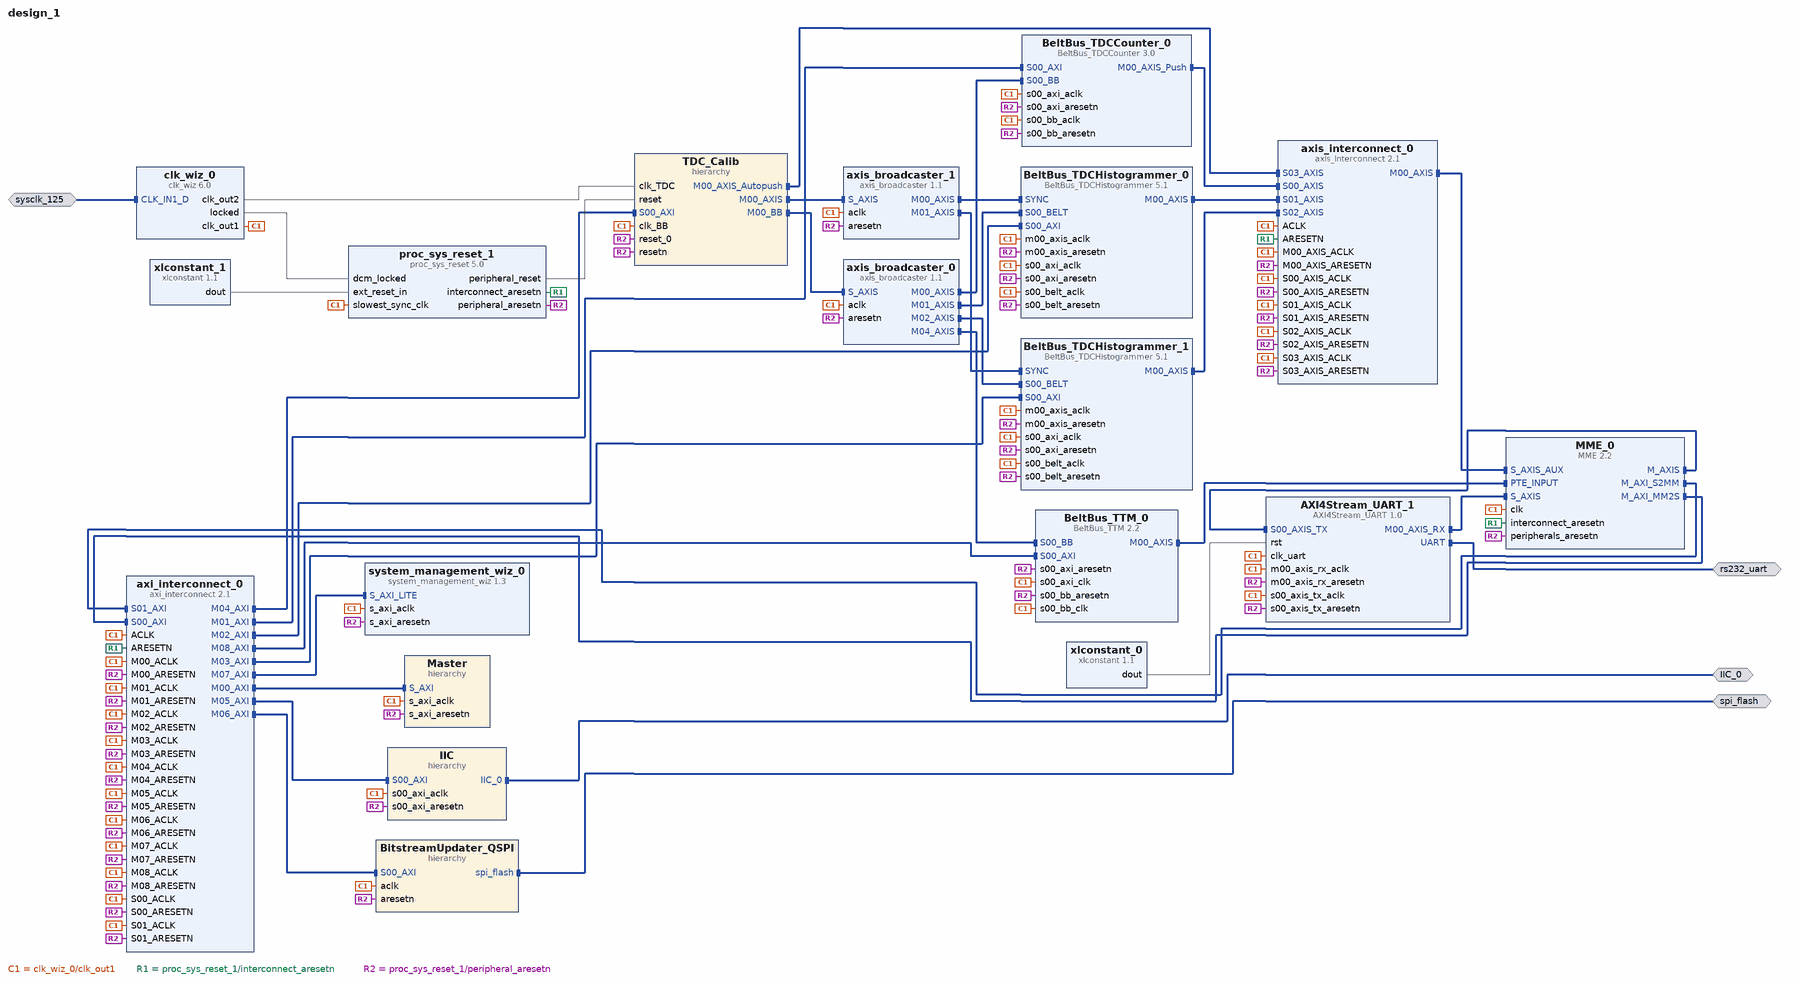
[diagram p0: block diagram of the top level]
# Vivado block design design_1, xcku040-ffva1156-2-e, Vivado 2020.2
create_bd_design design_1

create_bd_intf_port -mode Master -vlnv xilinx.com:interface:iic_rtl:1.0 IIC_0
create_bd_intf_port -mode Master -vlnv xilinx.com:interface:uart_rtl:1.0 rs232_uart
create_bd_intf_port -mode Master -vlnv xilinx.com:interface:spi_rtl:1.0 spi_flash
create_bd_intf_port -mode Slave -vlnv xilinx.com:interface:diff_clock_rtl:1.0 sysclk_125
set_property -dict {CONFIG.FREQ_HZ 125000000} [get_bd_intf_ports sysclk_125]

create_bd_cell -type ip -vlnv TimeEngineers:ip:AXI4Stream_UART:1.0 AXI4Stream_UART_1
set_property -dict [list \
  CONFIG.UART_BAUD_RATE 115200 \
  CONFIG.UART_BOARD_INTERFACE rs232_uart \
  CONFIG.USE_BOARD_FLOW true \
] [get_bd_cells AXI4Stream_UART_1]
create_bd_cell -type ip -vlnv DigiLAB:ip:BeltBus_TDCCounter:3.0 BeltBus_TDCCounter_0
set_property -dict {CONFIG.BIT_COARSE 8 CONFIG.BIT_FID 2 CONFIG.NUM_CH 3} [get_bd_cells BeltBus_TDCCounter_0]
create_bd_cell -type ip -vlnv DigiLAB:ip:BeltBus_TDCHistogrammer:5.1 BeltBus_TDCHistogrammer_0
set_property -dict [list \
  CONFIG.BIN_ADDR_WIDTH 13 \
  CONFIG.BIN_DATA_WIDTH 27 \
  CONFIG.BIT_COARSE 8 \
  CONFIG.BIT_FID 2 \
  CONFIG.BIT_OVERFLOW 16 \
  CONFIG.NUM_CH 3 \
] [get_bd_cells BeltBus_TDCHistogrammer_0]
create_bd_cell -type ip -vlnv DigiLAB:ip:BeltBus_TDCHistogrammer:5.1 BeltBus_TDCHistogrammer_1
set_property -dict [list \
  CONFIG.BIN_ADDR_WIDTH 13 \
  CONFIG.BIN_DATA_WIDTH 27 \
  CONFIG.BIT_COARSE 8 \
  CONFIG.BIT_FID 2 \
  CONFIG.BIT_OVERFLOW 16 \
  CONFIG.NUM_CH 3 \
] [get_bd_cells BeltBus_TDCHistogrammer_1]
create_bd_cell -type ip -vlnv DigiLAB:ip:BeltBus_TTM:2.2 BeltBus_TTM_0
set_property -dict [list \
  CONFIG.BIT_COARSE 8 \
  CONFIG.BIT_FID 2 \
  CONFIG.CUSTOM_TRESHOLD false \
  CONFIG.INS_TIMEOUT_CYCLES 100000000 \
  CONFIG.TAIL_FIFO_DEPTH 16384 \
  CONFIG.TLAST_GEN_TIMEOUT_CYCLES 30 \
] [get_bd_cells BeltBus_TTM_0]
create_bd_cell -type hier BitstreamUpdater_QSPI
create_bd_cell -type hier IIC
create_bd_cell -type ip -vlnv DigiLAB:hier:MME:2.2 MME_0
set_property -dict [list \
  CONFIG.MAX_PACKET_LENGTH_PACKETIZER 131072 \
  CONFIG.PTE_AUXILIARY_PORTS true \
  CONFIG.TLAST_00 yes \
] [get_bd_cells MME_0]
create_bd_cell -type hier Master
create_bd_cell -type hier TDC_Calib
create_bd_cell -type ip -vlnv xilinx.com:ip:axi_interconnect:2.1 axi_interconnect_0
set_property -dict {CONFIG.NUM_MI 9 CONFIG.NUM_SI 2} [get_bd_cells axi_interconnect_0]
create_bd_cell -type ip -vlnv xilinx.com:ip:axis_broadcaster:1.1 axis_broadcaster_0
set_property -dict [list \
  CONFIG.HAS_TREADY 0 \
  CONFIG.M00_TDATA_REMAP {tdata[31:0]} \
  CONFIG.M01_TDATA_REMAP {tdata[31:0]} \
  CONFIG.M02_TDATA_REMAP {tdata[31:0]} \
  CONFIG.M03_TDATA_REMAP {tdata[31:0]} \
  CONFIG.M04_TDATA_REMAP {tdata[31:0]} \
  CONFIG.M_TDATA_NUM_BYTES 4 \
  CONFIG.NUM_MI 5 \
  CONFIG.S_TDATA_NUM_BYTES 4 \
] [get_bd_cells axis_broadcaster_0]
create_bd_cell -type ip -vlnv xilinx.com:ip:axis_broadcaster:1.1 axis_broadcaster_1
set_property -dict [list \
  CONFIG.HAS_TREADY 0 \
  CONFIG.M00_TDATA_REMAP {tdata[39:0]} \
  CONFIG.M01_TDATA_REMAP {tdata[39:0]} \
  CONFIG.M02_TDATA_REMAP {tdata[31:0]} \
  CONFIG.M03_TDATA_REMAP {tdata[31:0]} \
  CONFIG.M_TDATA_NUM_BYTES 5 \
  CONFIG.NUM_MI 2 \
  CONFIG.S_TDATA_NUM_BYTES 5 \
] [get_bd_cells axis_broadcaster_1]
create_bd_cell -type ip -vlnv xilinx.com:ip:axis_interconnect:2.1 axis_interconnect_0
set_property -dict {CONFIG.NUM_MI 1 CONFIG.NUM_SI 4} [get_bd_cells axis_interconnect_0]
create_bd_cell -type ip -vlnv xilinx.com:ip:clk_wiz:6.0 clk_wiz_0
set_property -dict [list \
  CONFIG.CLKOUT1_DRIVES Buffer \
  CONFIG.CLKOUT1_JITTER 124.615 \
  CONFIG.CLKOUT1_PHASE_ERROR 96.948 \
  CONFIG.CLKOUT2_DRIVES Buffer \
  CONFIG.CLKOUT2_JITTER 92.027 \
  CONFIG.CLKOUT2_PHASE_ERROR 96.948 \
  CONFIG.CLKOUT2_REQUESTED_OUT_FREQ 500.000 \
  CONFIG.CLKOUT2_USED true \
  CONFIG.CLKOUT3_DRIVES Buffer \
  CONFIG.CLKOUT3_JITTER 242.717 \
  CONFIG.CLKOUT3_PHASE_ERROR 265.359 \
  CONFIG.CLKOUT3_REQUESTED_OUT_FREQ 100.000 \
  CONFIG.CLKOUT3_USED false \
  CONFIG.CLKOUT4_DRIVES Buffer \
  CONFIG.CLKOUT5_DRIVES Buffer \
  CONFIG.CLKOUT6_DRIVES Buffer \
  CONFIG.CLKOUT7_DRIVES Buffer \
  CONFIG.CLK_IN1_BOARD_INTERFACE sysclk_125 \
  CONFIG.CLK_IN2_BOARD_INTERFACE Custom \
  CONFIG.MMCM_CLKFBOUT_MULT_F 8.000 \
  CONFIG.MMCM_CLKIN2_PERIOD 10.000 \
  CONFIG.MMCM_CLKOUT0_DIVIDE_F 10.000 \
  CONFIG.MMCM_CLKOUT1_DIVIDE 2 \
  CONFIG.MMCM_CLKOUT2_DIVIDE 1 \
  CONFIG.MMCM_DIVCLK_DIVIDE 1 \
  CONFIG.NUM_OUT_CLKS 2 \
  CONFIG.PRIM_SOURCE Differential_clock_capable_pin \
  CONFIG.RESET_BOARD_INTERFACE Custom \
  CONFIG.SECONDARY_SOURCE Single_ended_clock_capable_pin \
  CONFIG.USE_BOARD_FLOW true \
  CONFIG.USE_INCLK_SWITCHOVER false \
  CONFIG.USE_PHASE_ALIGNMENT true \
  CONFIG.USE_RESET false \
] [get_bd_cells clk_wiz_0]
create_bd_cell -type ip -vlnv xilinx.com:ip:proc_sys_reset:5.0 proc_sys_reset_1
set_property -dict {CONFIG.RESET_BOARD_INTERFACE reset CONFIG.USE_BOARD_FLOW true} [get_bd_cells proc_sys_reset_1]
create_bd_cell -type ip -vlnv xilinx.com:ip:system_management_wiz:1.3 system_management_wiz_0
set_property -dict [list \
  CONFIG.ADC_CONVERSION_RATE 39 \
  CONFIG.CHANNEL_AVERAGING 256 \
  CONFIG.CHANNEL_ENABLE_CALIBRATION false \
  CONFIG.CHANNEL_ENABLE_VBRAM false \
  CONFIG.CHANNEL_ENABLE_VCCAUX false \
  CONFIG.CHANNEL_ENABLE_VCCINT false \
  CONFIG.DCLK_FREQUENCY 8.0 \
  CONFIG.OT_ALARM false \
  CONFIG.USER_TEMP_ALARM false \
  CONFIG.VCCAUX_ALARM false \
  CONFIG.VCCINT_ALARM false \
] [get_bd_cells system_management_wiz_0]
create_bd_cell -type ip -vlnv xilinx.com:ip:xlconstant:1.1 xlconstant_0
set_property -dict {CONFIG.CONST_VAL 0} [get_bd_cells xlconstant_0]
create_bd_cell -type ip -vlnv xilinx.com:ip:xlconstant:1.1 xlconstant_1
set_property -dict {CONFIG.CONST_VAL 0} [get_bd_cells xlconstant_1]

# ---- hierarchy /BitstreamUpdater_QSPI ----
current_bd_instance /BitstreamUpdater_QSPI
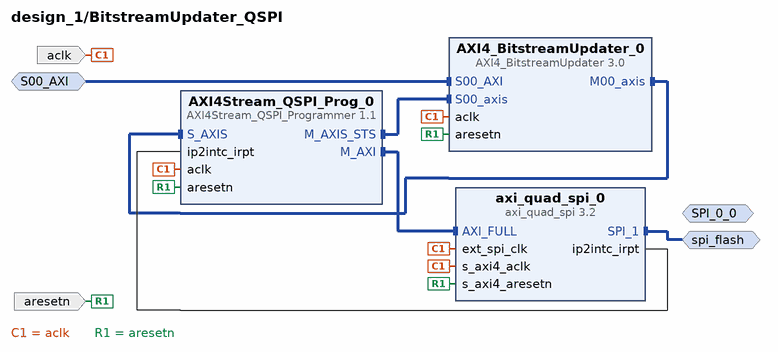
[diagram p1: block diagram inside /BitstreamUpdater_QSPI]
create_bd_intf_pin -mode Slave -vlnv xilinx.com:interface:aximm_rtl:1.0 S00_AXI
create_bd_intf_pin -mode Master -vlnv xilinx.com:interface:spi_rtl:1.0 SPI_0_0
create_bd_intf_pin -mode Master -vlnv xilinx.com:interface:spi_rtl:1.0 spi_flash
create_bd_pin -dir I -type clk aclk
create_bd_pin -dir I -type rst aresetn

create_bd_cell -type ip -vlnv DigiLAB:ip:AXI4Stream_QSPI_Programmer:1.1 AXI4Stream_QSPI_Prog_0
set_property -dict {CONFIG.END_ADDRESS 0x07F10000 CONFIG.MEMORY_SIZE 64} [get_bd_cells AXI4Stream_QSPI_Prog_0]
create_bd_cell -type ip -vlnv DigiLAB:ip:AXI4_BitstreamUpdater:3.0 AXI4_BitstreamUpdater_0
create_bd_cell -type ip -vlnv xilinx.com:ip:axi_quad_spi:3.2 axi_quad_spi_0
set_property -dict [list \
  CONFIG.C_FIFO_DEPTH 256 \
  CONFIG.C_SPI_MEMORY 2 \
  CONFIG.C_SPI_MODE 2 \
  CONFIG.C_TYPE_OF_AXI4_INTERFACE 1 \
  CONFIG.QSPI_BOARD_INTERFACE spi_flash \
  CONFIG.USE_BOARD_FLOW true \
] [get_bd_cells axi_quad_spi_0]

# ---- hierarchy /IIC ----
current_bd_instance /IIC
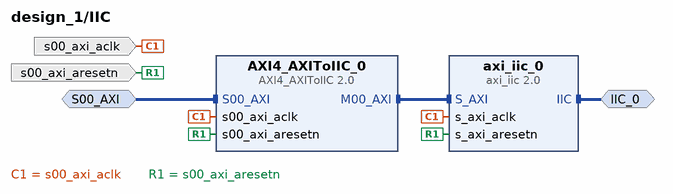
[diagram p2: block diagram inside /IIC]
create_bd_intf_pin -mode Master -vlnv xilinx.com:interface:iic_rtl:1.0 IIC_0
create_bd_intf_pin -mode Slave -vlnv xilinx.com:interface:aximm_rtl:1.0 S00_AXI
create_bd_pin -dir I -type clk s00_axi_aclk
create_bd_pin -dir I -type rst s00_axi_aresetn

create_bd_cell -type ip -vlnv DigiLAB:ip:AXI4_AXIToIIC:2.0 AXI4_AXIToIIC_0
create_bd_cell -type ip -vlnv xilinx.com:ip:axi_iic:2.0 axi_iic_0
set_property -dict {CONFIG.IIC_BOARD_INTERFACE iic_main CONFIG.USE_BOARD_FLOW true} [get_bd_cells axi_iic_0]

# ---- hierarchy /Master ----
current_bd_instance /Master
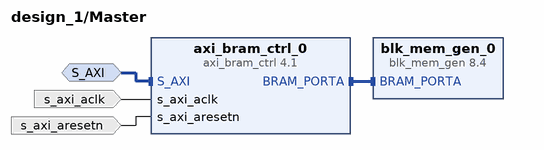
[diagram p3: block diagram inside /Master]
create_bd_intf_pin -mode Slave -vlnv xilinx.com:interface:aximm_rtl:1.0 S_AXI
create_bd_pin -dir I -type clk s_axi_aclk
create_bd_pin -dir I -type rst s_axi_aresetn

create_bd_cell -type ip -vlnv xilinx.com:ip:axi_bram_ctrl:4.1 axi_bram_ctrl_0
set_property -dict {CONFIG.SINGLE_PORT_BRAM 1 CONFIG.SUPPORTS_NARROW_BURST 0} [get_bd_cells axi_bram_ctrl_0]
create_bd_cell -type ip -vlnv xilinx.com:ip:blk_mem_gen:8.4 blk_mem_gen_0
set_property -dict [list \
  CONFIG.Coe_File ../../../../../../../../../master_v70.coe \
  CONFIG.EN_SAFETY_CKT true \
  CONFIG.Enable_32bit_Address true \
  CONFIG.Load_Init_File true \
  CONFIG.Memory_Type Single_Port_ROM \
  CONFIG.Port_A_Write_Rate 0 \
  CONFIG.Register_PortA_Output_of_Memory_Primitives false \
  CONFIG.Use_RSTA_Pin true \
  CONFIG.use_bram_block BRAM_Controller \
] [get_bd_cells blk_mem_gen_0]

# ---- hierarchy /TDC_Calib ----
current_bd_instance /TDC_Calib
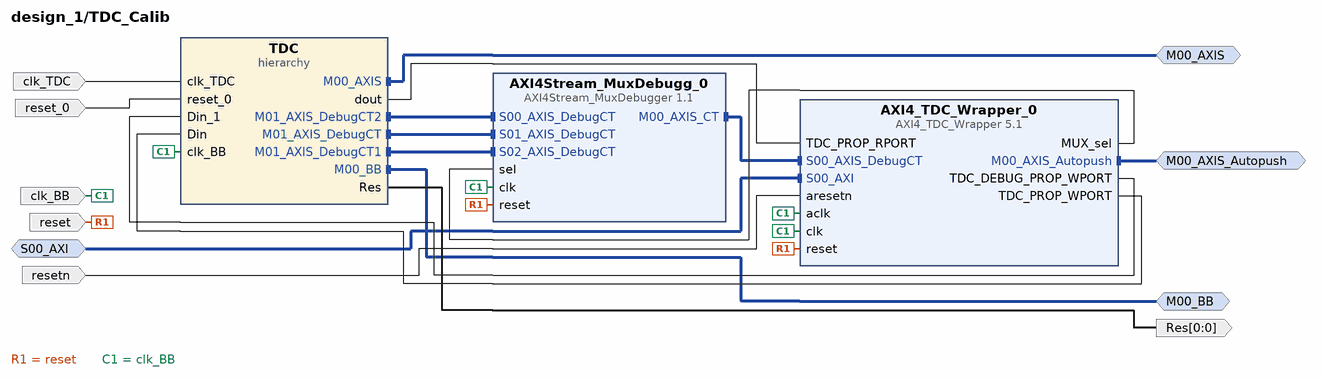
[diagram p4: block diagram inside /TDC_Calib]
create_bd_intf_pin -mode Master -vlnv xilinx.com:interface:axis_rtl:1.0 M00_AXIS
create_bd_intf_pin -mode Master -vlnv xilinx.com:interface:axis_rtl:1.0 M00_AXIS_Autopush
create_bd_intf_pin -mode Master -vlnv xilinx.com:interface:axis_rtl:1.0 M00_BB
create_bd_intf_pin -mode Slave -vlnv xilinx.com:interface:aximm_rtl:1.0 S00_AXI
create_bd_pin -dir O -from 0 -to 0 Res
create_bd_pin -dir I -type clk clk_BB
create_bd_pin -dir I -type clk clk_TDC
create_bd_pin -dir I -type rst reset
create_bd_pin -dir I -type rst reset_0
create_bd_pin -dir I -type rst resetn

create_bd_cell -type ip -vlnv DigiLAB:ip:AXI4Stream_MuxDebugger:1.1 AXI4Stream_MuxDebugg_0
set_property -dict {CONFIG.DEBUG_MODE_CC false CONFIG.NUM_CHANNEL 3} [get_bd_cells AXI4Stream_MuxDebugg_0]
create_bd_cell -type ip -vlnv DigiLAB:ip:AXI4_TDC_Wrapper:5.1 AXI4_TDC_Wrapper_0
set_property -dict [list \
  CONFIG.BIT_CALIBRATION 24 \
  CONFIG.BIT_RESOLUTION 11 \
  CONFIG.BIT_UNCALIBRATED 11 \
  CONFIG.C_S00_AXI_ADDR_ABS 0x44A40000 \
  CONFIG.DEBUG_MODE_CC false \
  CONFIG.DEF_CH_STRETCHERLENGTH 6 \
  CONFIG.DEF_SYNC_STRETCHERLENGTH 1 \
  CONFIG.PW_StretcherLength 3 \
  CONFIG.TDC_CH_RPORT_WIDTH 65 \
  CONFIG.TDC_DISABLE_DEBUG_PORTS_READOUT false \
  CONFIG.TDC_ENABLE_DEBUG_PORTS true \
] [get_bd_cells AXI4_TDC_Wrapper_0]
create_bd_cell -type hier TDC

# ---- hierarchy /TDC_Calib/TDC ----
current_bd_instance /TDC_Calib/TDC
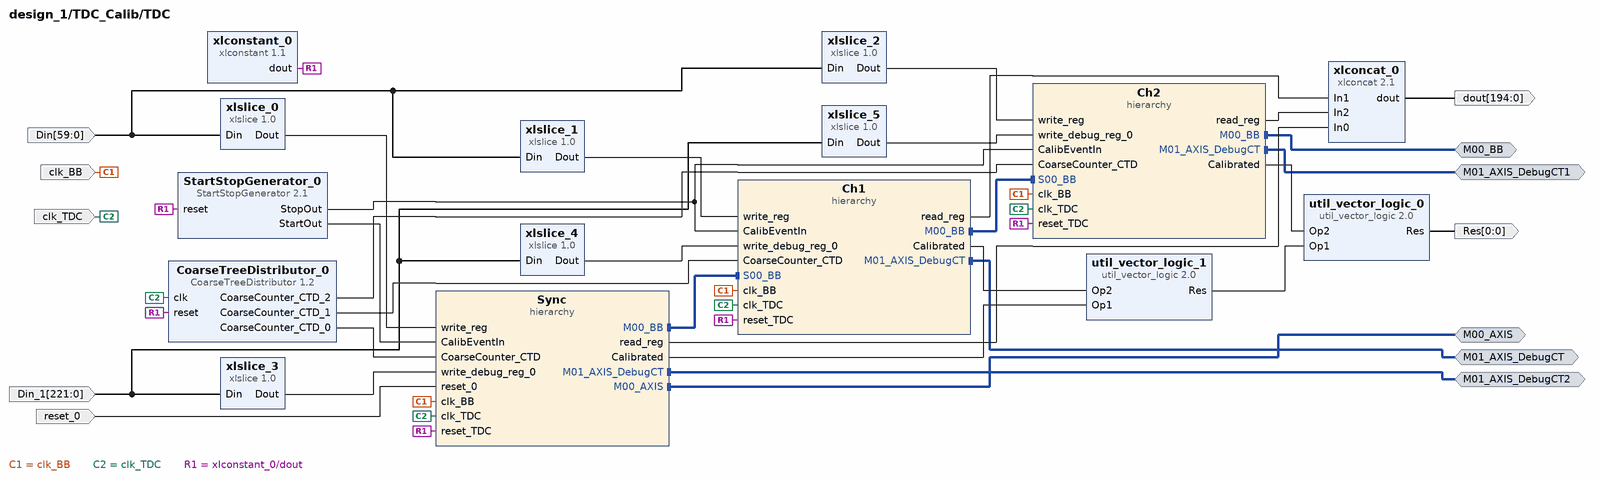
[diagram p5: block diagram inside /TDC_Calib/TDC]
create_bd_intf_pin -mode Master -vlnv xilinx.com:interface:axis_rtl:1.0 M00_AXIS
create_bd_intf_pin -mode Master -vlnv xilinx.com:interface:axis_rtl:1.0 M00_BB
create_bd_intf_pin -mode Master -vlnv xilinx.com:interface:axis_rtl:1.0 M01_AXIS_DebugCT
create_bd_intf_pin -mode Master -vlnv xilinx.com:interface:axis_rtl:1.0 M01_AXIS_DebugCT1
create_bd_intf_pin -mode Master -vlnv xilinx.com:interface:axis_rtl:1.0 M01_AXIS_DebugCT2
create_bd_pin -dir I -from 59 -to 0 Din
create_bd_pin -dir I -from 221 -to 0 Din_1
create_bd_pin -dir O -from 0 -to 0 Res
create_bd_pin -dir I -type clk clk_BB
create_bd_pin -dir I -type clk clk_TDC
create_bd_pin -dir O -from 194 -to 0 dout
create_bd_pin -dir I -type rst reset_0

create_bd_cell -type hier Ch1
create_bd_cell -type hier Ch2
create_bd_cell -type ip -vlnv DigiLAB:ip:CoarseTreeDistributor:1.2 CoarseTreeDistributor_0
set_property -dict {CONFIG.BIT_COARSE 4 CONFIG.NUMBER_OF_OUTPUT 3} [get_bd_cells CoarseTreeDistributor_0]
create_bd_cell -type ip -vlnv DigiLAB:ip:StartStopGenerator:2.1 StartStopGenerator_0
set_property -dict [list \
  CONFIG.CLK_SELECT {RING OSCILLATOR} \
  CONFIG.DIVIDER_INIT 15 \
  CONFIG.HALF_DIVIDER 5 \
  CONFIG.TUNING_MODE false \
] [get_bd_cells StartStopGenerator_0]
create_bd_cell -type hier Sync
create_bd_cell -type ip -vlnv xilinx.com:ip:util_vector_logic:2.0 util_vector_logic_0
set_property -dict {CONFIG.C_SIZE 1} [get_bd_cells util_vector_logic_0]
create_bd_cell -type ip -vlnv xilinx.com:ip:util_vector_logic:2.0 util_vector_logic_1
set_property -dict {CONFIG.C_SIZE 1} [get_bd_cells util_vector_logic_1]
create_bd_cell -type ip -vlnv xilinx.com:ip:xlconcat:2.1 xlconcat_0
set_property -dict {CONFIG.IN0_WIDTH 65 CONFIG.IN1_WIDTH 65 CONFIG.IN2_WIDTH 65 CONFIG.NUM_PORTS 3} [get_bd_cells xlconcat_0]
create_bd_cell -type ip -vlnv xilinx.com:ip:xlconstant:1.1 xlconstant_0
set_property -dict {CONFIG.CONST_VAL 0} [get_bd_cells xlconstant_0]
create_bd_cell -type ip -vlnv xilinx.com:ip:xlslice:1.0 xlslice_0
set_property -dict {CONFIG.DIN_FROM 19 CONFIG.DIN_WIDTH 60 CONFIG.DOUT_WIDTH 20} [get_bd_cells xlslice_0]
create_bd_cell -type ip -vlnv xilinx.com:ip:xlslice:1.0 xlslice_1
set_property -dict {CONFIG.DIN_FROM 39 CONFIG.DIN_TO 20 CONFIG.DIN_WIDTH 60 CONFIG.DOUT_WIDTH 20} [get_bd_cells xlslice_1]
create_bd_cell -type ip -vlnv xilinx.com:ip:xlslice:1.0 xlslice_2
set_property -dict {CONFIG.DIN_FROM 59 CONFIG.DIN_TO 40 CONFIG.DIN_WIDTH 60 CONFIG.DOUT_WIDTH 20} [get_bd_cells xlslice_2]
create_bd_cell -type ip -vlnv xilinx.com:ip:xlslice:1.0 xlslice_3
set_property -dict {CONFIG.DIN_FROM 73 CONFIG.DIN_WIDTH 222 CONFIG.DOUT_WIDTH 74} [get_bd_cells xlslice_3]
create_bd_cell -type ip -vlnv xilinx.com:ip:xlslice:1.0 xlslice_4
set_property -dict {CONFIG.DIN_FROM 147 CONFIG.DIN_TO 74 CONFIG.DIN_WIDTH 222 CONFIG.DOUT_WIDTH 74} [get_bd_cells xlslice_4]
create_bd_cell -type ip -vlnv xilinx.com:ip:xlslice:1.0 xlslice_5
set_property -dict {CONFIG.DIN_FROM 221 CONFIG.DIN_TO 148 CONFIG.DIN_WIDTH 222 CONFIG.DOUT_WIDTH 74} [get_bd_cells xlslice_5]

# ---- hierarchy /TDC_Calib/TDC/Ch1 ----
current_bd_instance /TDC_Calib/TDC/Ch1
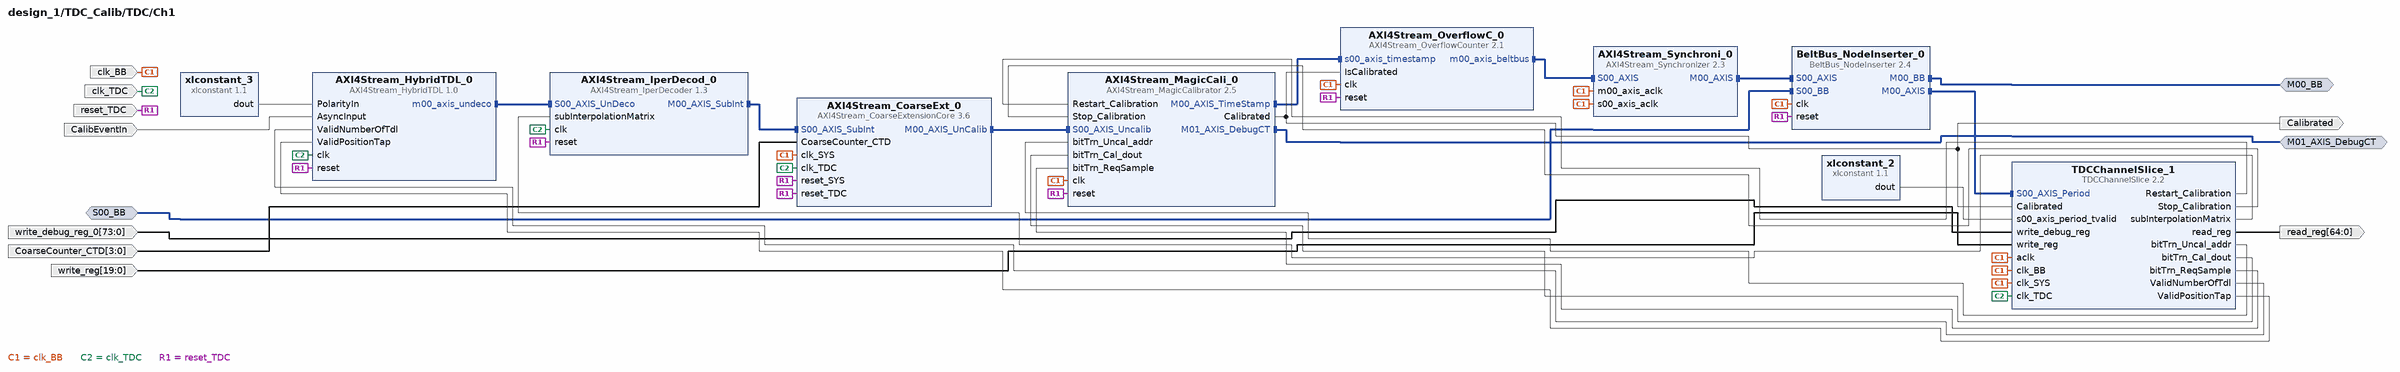
[diagram p6: block diagram inside /TDC_Calib/TDC/Ch1]
create_bd_intf_pin -mode Master -vlnv xilinx.com:interface:axis_rtl:1.0 M00_BB
create_bd_intf_pin -mode Master -vlnv xilinx.com:interface:axis_rtl:1.0 M01_AXIS_DebugCT
create_bd_intf_pin -mode Slave -vlnv xilinx.com:interface:axis_rtl:1.0 S00_BB
create_bd_pin -dir I -type data CalibEventIn
create_bd_pin -dir O -type data Calibrated
create_bd_pin -dir I -from 3 -to 0 CoarseCounter_CTD
create_bd_pin -dir I -type clk clk_BB
create_bd_pin -dir I -type clk clk_TDC
create_bd_pin -dir O -from 64 -to 0 -type data read_reg
create_bd_pin -dir I -type rst reset_TDC
create_bd_pin -dir I -from 73 -to 0 -type data write_debug_reg_0
create_bd_pin -dir I -from 19 -to 0 -type data write_reg

create_bd_cell -type ip -vlnv DigiLAB:ip:TDCChannelSlice:2.2 TDCChannelSlice_1
set_property -dict {CONFIG.BIT_COARSE 8 CONFIG.BIT_DIVIDER 4 CONFIG.TDC_ENABLE_DEBUG_PORTS true} [get_bd_cells TDCChannelSlice_1]
create_bd_cell -type ip -vlnv xilinx.com:ip:xlconstant:1.1 xlconstant_2
set_property -dict {CONFIG.CONST_VAL 0} [get_bd_cells xlconstant_2]
create_bd_cell -type ip -vlnv DigiLAB:ip:AXI4Stream_IperDecoder:1.3 AXI4Stream_IperDecod_0
set_property -dict [list \
  CONFIG.BIT_BUBBLE 16 \
  CONFIG.BIT_PIPE_COARSE 1 \
  CONFIG.BIT_TDL 512 \
  CONFIG.DEBUG_MODE true \
  CONFIG.NUMBER_OF_TDL 4 \
  CONFIG.TYPE_EDGE_0 UP \
  CONFIG.TYPE_EDGE_1 UP \
  CONFIG.TYPE_EDGE_2 UP \
  CONFIG.TYPE_EDGE_3 UP \
] [get_bd_cells AXI4Stream_IperDecod_0]
create_bd_cell -type ip -vlnv DigiLAB:ip:AXI4Stream_CoarseExtensionCore:3.6 AXI4Stream_CoarseExt_0
set_property -dict [list \
  CONFIG.BIT_COARSE 4 \
  CONFIG.BIT_FID 2 \
  CONFIG.BIT_SUB_INT 11 \
  CONFIG.BIT_UNCALIBRATED 11 \
  CONFIG.CEC_VS_CTD_COUNTER CTD \
] [get_bd_cells AXI4Stream_CoarseExt_0]
create_bd_cell -type ip -vlnv DigiLAB:ip:AXI4Stream_MagicCalibrator:2.5 AXI4Stream_MagicCali_0
set_property -dict [list \
  CONFIG.BIT_COARSE 4 \
  CONFIG.BIT_FID 2 \
  CONFIG.BIT_UNCALIBRATED 11 \
  CONFIG.DEBUG_MODE_CT true \
] [get_bd_cells AXI4Stream_MagicCali_0]
create_bd_cell -type ip -vlnv DigiLAB:ip:AXI4Stream_OverflowCounter:2.1 AXI4Stream_OverflowC_0
create_bd_cell -type ip -vlnv DigiLAB:ip:AXI4Stream_Synchronizer:2.3 AXI4Stream_Synchroni_0
set_property -dict {CONFIG.DATA_WIDTH 32 CONFIG.MODE_SEL FIFO} [get_bd_cells AXI4Stream_Synchroni_0]
create_bd_cell -type ip -vlnv DigiLAB:ip:BeltBus_NodeInserter:2.4 BeltBus_NodeInserter_0
set_property -dict [list \
  CONFIG.BIT_COARSE 8 \
  CONFIG.BIT_FID 2 \
  CONFIG.HOLD_ON_INTEGRAL 6 \
  CONFIG.HOLD_ON_MIN_MOD 0 \
  CONFIG.NUM_CH 1 \
  CONFIG.NUM_NODE 1 \
  CONFIG.PASS_THROUGH Both \
] [get_bd_cells BeltBus_NodeInserter_0]
create_bd_cell -type ip -vlnv xilinx.com:ip:xlconstant:1.1 xlconstant_3
create_bd_cell -type ip -vlnv DigiLAB:ip:AXI4Stream_HybridTDL:1.0 AXI4Stream_HybridTDL_0
set_property -dict [list \
  CONFIG.BIT_SMP_PRE_TDL 128 \
  CONFIG.DEBUG_MODE true \
  CONFIG.NUMBER_OF_CARRY_CHAINS 2 \
  CONFIG.NUMBER_OF_DSP_CHAINS 2 \
  CONFIG.NUM_TAP_PRE_TDL 128 \
  CONFIG.TYPE_TDL_0 O \
  CONFIG.TYPE_TDL_1 O \
] [get_bd_cells AXI4Stream_HybridTDL_0]

# ---- hierarchy /TDC_Calib/TDC/Ch2 ----
current_bd_instance /TDC_Calib/TDC/Ch2
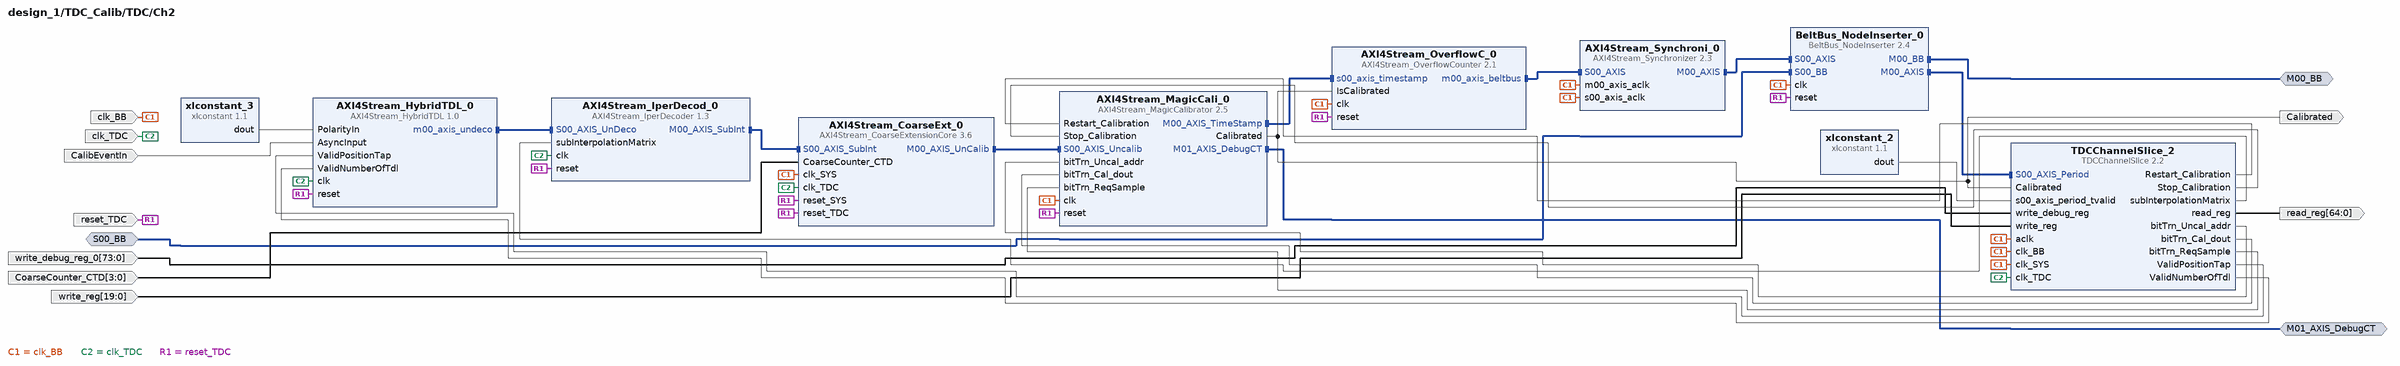
[diagram p7: block diagram inside /TDC_Calib/TDC/Ch2]
create_bd_intf_pin -mode Master -vlnv xilinx.com:interface:axis_rtl:1.0 M00_BB
create_bd_intf_pin -mode Master -vlnv xilinx.com:interface:axis_rtl:1.0 M01_AXIS_DebugCT
create_bd_intf_pin -mode Slave -vlnv xilinx.com:interface:axis_rtl:1.0 S00_BB
create_bd_pin -dir I -type data CalibEventIn
create_bd_pin -dir O -type data Calibrated
create_bd_pin -dir I -from 3 -to 0 CoarseCounter_CTD
create_bd_pin -dir I -type clk clk_BB
create_bd_pin -dir I -type clk clk_TDC
create_bd_pin -dir O -from 64 -to 0 -type data read_reg
create_bd_pin -dir I -type rst reset_TDC
create_bd_pin -dir I -from 73 -to 0 -type data write_debug_reg_0
create_bd_pin -dir I -from 19 -to 0 -type data write_reg

create_bd_cell -type ip -vlnv DigiLAB:ip:TDCChannelSlice:2.2 TDCChannelSlice_2
set_property -dict {CONFIG.BIT_COARSE 8 CONFIG.BIT_DIVIDER 4 CONFIG.TDC_ENABLE_DEBUG_PORTS true} [get_bd_cells TDCChannelSlice_2]
create_bd_cell -type ip -vlnv xilinx.com:ip:xlconstant:1.1 xlconstant_2
set_property -dict {CONFIG.CONST_VAL 0} [get_bd_cells xlconstant_2]
create_bd_cell -type ip -vlnv DigiLAB:ip:AXI4Stream_IperDecoder:1.3 AXI4Stream_IperDecod_0
set_property -dict [list \
  CONFIG.BIT_BUBBLE 16 \
  CONFIG.BIT_PIPE_COARSE 1 \
  CONFIG.BIT_TDL 512 \
  CONFIG.DEBUG_MODE true \
  CONFIG.NUMBER_OF_TDL 4 \
  CONFIG.TYPE_EDGE_0 UP \
  CONFIG.TYPE_EDGE_1 UP \
  CONFIG.TYPE_EDGE_2 UP \
  CONFIG.TYPE_EDGE_3 UP \
] [get_bd_cells AXI4Stream_IperDecod_0]
create_bd_cell -type ip -vlnv DigiLAB:ip:AXI4Stream_CoarseExtensionCore:3.6 AXI4Stream_CoarseExt_0
set_property -dict [list \
  CONFIG.BIT_COARSE 4 \
  CONFIG.BIT_FID 2 \
  CONFIG.BIT_SUB_INT 11 \
  CONFIG.BIT_UNCALIBRATED 11 \
  CONFIG.CEC_VS_CTD_COUNTER CTD \
] [get_bd_cells AXI4Stream_CoarseExt_0]
create_bd_cell -type ip -vlnv DigiLAB:ip:AXI4Stream_MagicCalibrator:2.5 AXI4Stream_MagicCali_0
set_property -dict [list \
  CONFIG.BIT_COARSE 4 \
  CONFIG.BIT_FID 2 \
  CONFIG.BIT_UNCALIBRATED 11 \
  CONFIG.DEBUG_MODE_CT true \
] [get_bd_cells AXI4Stream_MagicCali_0]
create_bd_cell -type ip -vlnv DigiLAB:ip:AXI4Stream_OverflowCounter:2.1 AXI4Stream_OverflowC_0
create_bd_cell -type ip -vlnv DigiLAB:ip:AXI4Stream_Synchronizer:2.3 AXI4Stream_Synchroni_0
set_property -dict {CONFIG.DATA_WIDTH 32 CONFIG.MODE_SEL FIFO} [get_bd_cells AXI4Stream_Synchroni_0]
create_bd_cell -type ip -vlnv DigiLAB:ip:BeltBus_NodeInserter:2.4 BeltBus_NodeInserter_0
set_property -dict [list \
  CONFIG.BIT_COARSE 8 \
  CONFIG.BIT_FID 2 \
  CONFIG.HOLD_ON_INTEGRAL 6 \
  CONFIG.HOLD_ON_MIN_MOD 0 \
  CONFIG.NUM_CH 2 \
  CONFIG.NUM_NODE 2 \
  CONFIG.PASS_THROUGH Both \
] [get_bd_cells BeltBus_NodeInserter_0]
create_bd_cell -type ip -vlnv xilinx.com:ip:xlconstant:1.1 xlconstant_3
create_bd_cell -type ip -vlnv DigiLAB:ip:AXI4Stream_HybridTDL:1.0 AXI4Stream_HybridTDL_0
set_property -dict [list \
  CONFIG.BIT_SMP_PRE_TDL 128 \
  CONFIG.DEBUG_MODE true \
  CONFIG.NUMBER_OF_CARRY_CHAINS 2 \
  CONFIG.NUMBER_OF_DSP_CHAINS 2 \
  CONFIG.NUM_TAP_PRE_TDL 128 \
  CONFIG.TYPE_TDL_0 O \
  CONFIG.TYPE_TDL_1 O \
] [get_bd_cells AXI4Stream_HybridTDL_0]

# ---- hierarchy /TDC_Calib/TDC/Sync ----
current_bd_instance /TDC_Calib/TDC/Sync
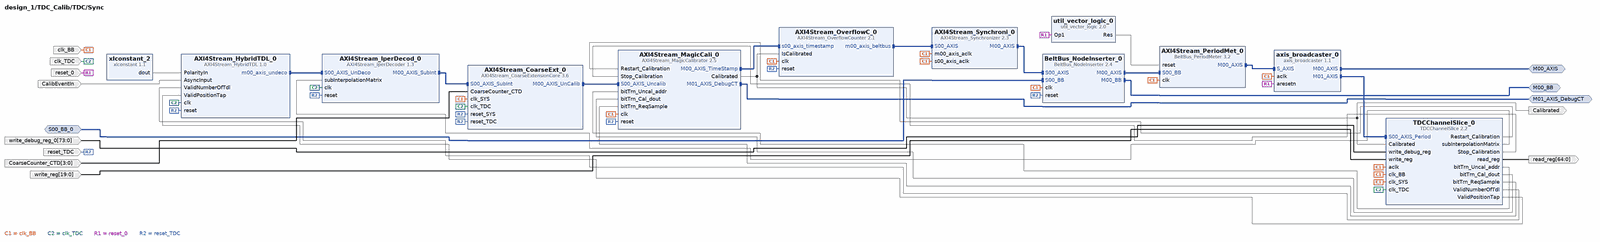
[diagram p8: block diagram inside /TDC_Calib/TDC/Sync, whole]
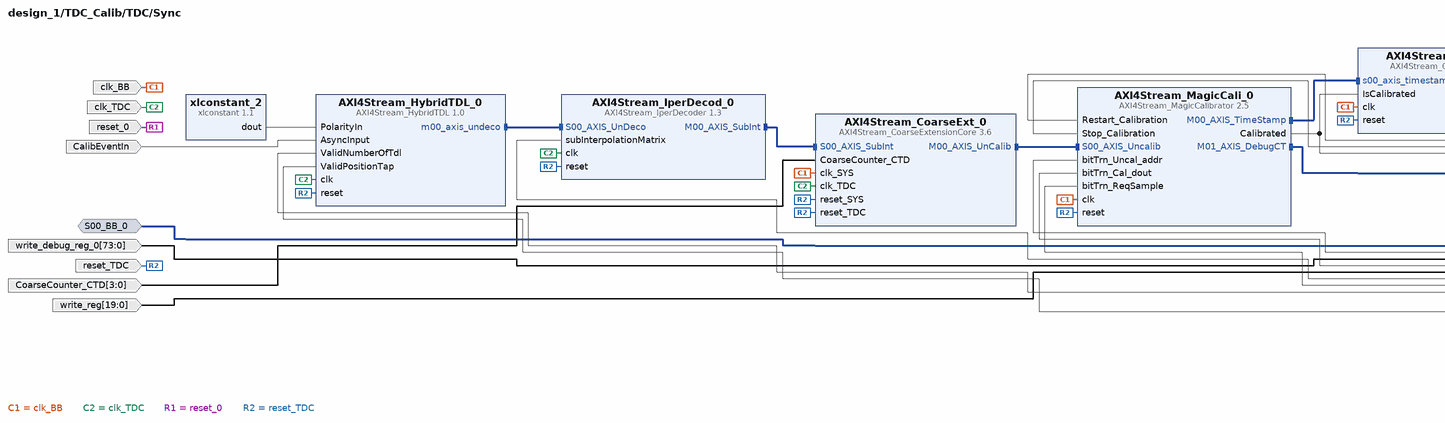
[diagram p9: block diagram inside /TDC_Calib/TDC/Sync, left part]
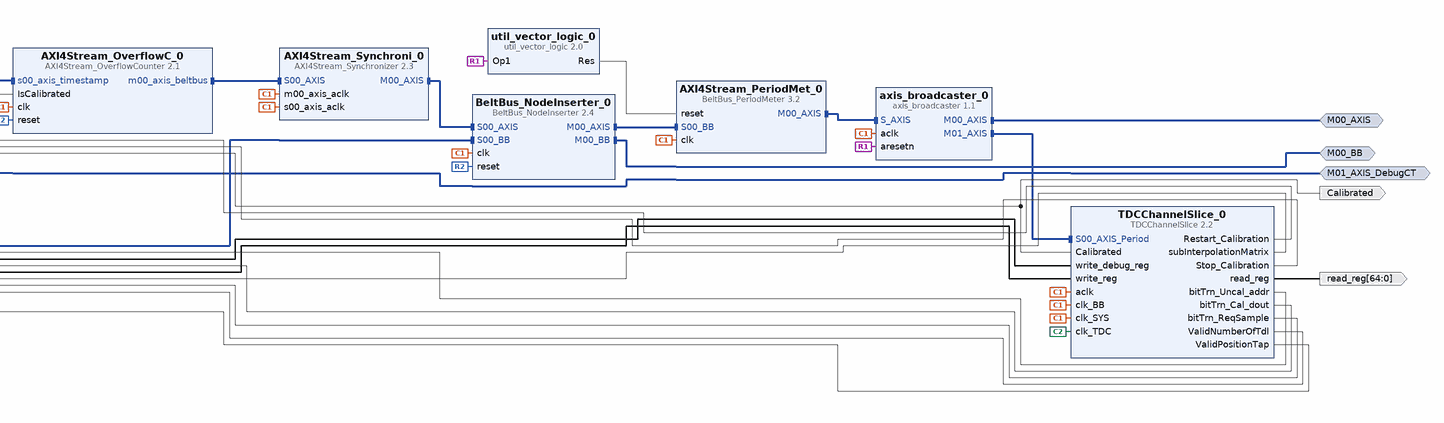
[diagram p10: block diagram inside /TDC_Calib/TDC/Sync, right part]
create_bd_intf_pin -mode Master -vlnv xilinx.com:interface:axis_rtl:1.0 M00_AXIS
create_bd_intf_pin -mode Master -vlnv xilinx.com:interface:axis_rtl:1.0 M00_BB
create_bd_intf_pin -mode Master -vlnv xilinx.com:interface:axis_rtl:1.0 M01_AXIS_DebugCT
create_bd_intf_pin -mode Slave -vlnv xilinx.com:interface:axis_rtl:1.0 S00_BB_0
create_bd_pin -dir I -type data CalibEventIn
create_bd_pin -dir O -type data Calibrated
create_bd_pin -dir I -from 3 -to 0 CoarseCounter_CTD
create_bd_pin -dir I -type clk clk_BB
create_bd_pin -dir I -type clk clk_TDC
create_bd_pin -dir O -from 64 -to 0 -type data read_reg
create_bd_pin -dir I -type rst reset_0
create_bd_pin -dir I -type rst reset_TDC
create_bd_pin -dir I -from 73 -to 0 -type data write_debug_reg_0
create_bd_pin -dir I -from 19 -to 0 -type data write_reg

create_bd_cell -type ip -vlnv DigiLAB:ip:BeltBus_PeriodMeter:3.2 AXI4Stream_PeriodMet_0
set_property -dict {CONFIG.BIT_COARSE 8 CONFIG.BIT_FID 2 CONFIG.BIT_OVERFLOW 16} [get_bd_cells AXI4Stream_PeriodMet_0]
create_bd_cell -type ip -vlnv DigiLAB:ip:TDCChannelSlice:2.2 TDCChannelSlice_0
set_property -dict [list \
  CONFIG.BIT_COARSE 8 \
  CONFIG.BIT_DIVIDER 4 \
  CONFIG.BIT_OVERFLOW 16 \
  CONFIG.TDC_ENABLE_DEBUG_PORTS true \
] [get_bd_cells TDCChannelSlice_0]
create_bd_cell -type ip -vlnv xilinx.com:ip:axis_broadcaster:1.1 axis_broadcaster_0
set_property -dict [list \
  CONFIG.HAS_TREADY 0 \
  CONFIG.M00_TDATA_REMAP {tdata[39:0]} \
  CONFIG.M01_TDATA_REMAP {tdata[39:0]} \
  CONFIG.M_TDATA_NUM_BYTES 5 \
  CONFIG.S_TDATA_NUM_BYTES 5 \
] [get_bd_cells axis_broadcaster_0]
create_bd_cell -type ip -vlnv xilinx.com:ip:util_vector_logic:2.0 util_vector_logic_0
set_property -dict {CONFIG.C_OPERATION not CONFIG.C_SIZE 1} [get_bd_cells util_vector_logic_0]
create_bd_cell -type ip -vlnv DigiLAB:ip:AXI4Stream_IperDecoder:1.3 AXI4Stream_IperDecod_0
set_property -dict [list \
  CONFIG.BIT_BUBBLE 16 \
  CONFIG.BIT_PIPE_COARSE 1 \
  CONFIG.BIT_TDL 512 \
  CONFIG.DEBUG_MODE true \
  CONFIG.NUMBER_OF_TDL 4 \
  CONFIG.TYPE_EDGE_0 UP \
  CONFIG.TYPE_EDGE_1 UP \
  CONFIG.TYPE_EDGE_2 UP \
  CONFIG.TYPE_EDGE_3 UP \
] [get_bd_cells AXI4Stream_IperDecod_0]
create_bd_cell -type ip -vlnv DigiLAB:ip:AXI4Stream_CoarseExtensionCore:3.6 AXI4Stream_CoarseExt_0
set_property -dict [list \
  CONFIG.BIT_COARSE 4 \
  CONFIG.BIT_FID 2 \
  CONFIG.BIT_SUB_INT 11 \
  CONFIG.BIT_UNCALIBRATED 11 \
  CONFIG.CEC_VS_CTD_COUNTER CTD \
] [get_bd_cells AXI4Stream_CoarseExt_0]
create_bd_cell -type ip -vlnv DigiLAB:ip:AXI4Stream_MagicCalibrator:2.5 AXI4Stream_MagicCali_0
set_property -dict [list \
  CONFIG.BIT_COARSE 4 \
  CONFIG.BIT_FID 2 \
  CONFIG.BIT_UNCALIBRATED 11 \
  CONFIG.DEBUG_MODE_CT true \
] [get_bd_cells AXI4Stream_MagicCali_0]
create_bd_cell -type ip -vlnv DigiLAB:ip:AXI4Stream_OverflowCounter:2.1 AXI4Stream_OverflowC_0
create_bd_cell -type ip -vlnv DigiLAB:ip:AXI4Stream_Synchronizer:2.3 AXI4Stream_Synchroni_0
set_property -dict {CONFIG.DATA_WIDTH 32 CONFIG.MODE_SEL FIFO} [get_bd_cells AXI4Stream_Synchroni_0]
create_bd_cell -type ip -vlnv DigiLAB:ip:BeltBus_NodeInserter:2.4 BeltBus_NodeInserter_0
set_property -dict [list \
  CONFIG.BIT_COARSE 8 \
  CONFIG.BIT_FID 2 \
  CONFIG.HOLD_ON_INTEGRAL 6 \
  CONFIG.HOLD_ON_MIN_MOD 0 \
  CONFIG.PASS_THROUGH Both \
] [get_bd_cells BeltBus_NodeInserter_0]
create_bd_cell -type ip -vlnv xilinx.com:ip:xlconstant:1.1 xlconstant_2
create_bd_cell -type ip -vlnv DigiLAB:ip:AXI4Stream_HybridTDL:1.0 AXI4Stream_HybridTDL_0
set_property -dict [list \
  CONFIG.BIT_SMP_PRE_TDL 128 \
  CONFIG.DEBUG_MODE true \
  CONFIG.NUMBER_OF_CARRY_CHAINS 2 \
  CONFIG.NUMBER_OF_DSP_CHAINS 2 \
  CONFIG.NUM_TAP_PRE_TDL 128 \
  CONFIG.TYPE_TDL_0 O \
  CONFIG.TYPE_TDL_1 O \
] [get_bd_cells AXI4Stream_HybridTDL_0]

# ---- connections ----

current_bd_instance /BitstreamUpdater_QSPI
connect_bd_intf_net [get_bd_intf_pins AXI4Stream_QSPI_Prog_0/M_AXI] [get_bd_intf_pins axi_quad_spi_0/AXI_FULL]
connect_bd_intf_net [get_bd_intf_pins AXI4Stream_QSPI_Prog_0/M_AXIS_STS] [get_bd_intf_pins AXI4_BitstreamUpdater_0/S00_axis]
connect_bd_intf_net [get_bd_intf_pins S00_AXI] [get_bd_intf_pins AXI4_BitstreamUpdater_0/S00_AXI]
connect_bd_intf_net [get_bd_intf_pins AXI4Stream_QSPI_Prog_0/S_AXIS] [get_bd_intf_pins AXI4_BitstreamUpdater_0/M00_axis]
connect_bd_intf_net [get_bd_intf_pins spi_flash] [get_bd_intf_pins axi_quad_spi_0/SPI_1]
connect_bd_net [get_bd_pins aclk] \
  [get_bd_pins AXI4Stream_QSPI_Prog_0/aclk] [get_bd_pins AXI4_BitstreamUpdater_0/aclk] \
  [get_bd_pins axi_quad_spi_0/ext_spi_clk] [get_bd_pins axi_quad_spi_0/s_axi4_aclk]
connect_bd_net [get_bd_pins aresetn] \
  [get_bd_pins AXI4Stream_QSPI_Prog_0/aresetn] [get_bd_pins AXI4_BitstreamUpdater_0/aresetn] \
  [get_bd_pins axi_quad_spi_0/s_axi4_aresetn]
connect_bd_net [get_bd_pins axi_quad_spi_0/ip2intc_irpt] [get_bd_pins AXI4Stream_QSPI_Prog_0/ip2intc_irpt]

current_bd_instance /IIC
connect_bd_intf_net [get_bd_intf_pins S00_AXI] [get_bd_intf_pins AXI4_AXIToIIC_0/S00_AXI]
connect_bd_intf_net [get_bd_intf_pins AXI4_AXIToIIC_0/M00_AXI] [get_bd_intf_pins axi_iic_0/S_AXI]
connect_bd_intf_net [get_bd_intf_pins IIC_0] [get_bd_intf_pins axi_iic_0/IIC]
connect_bd_net [get_bd_pins s00_axi_aclk] [get_bd_pins AXI4_AXIToIIC_0/s00_axi_aclk] [get_bd_pins axi_iic_0/s_axi_aclk]
connect_bd_net [get_bd_pins s00_axi_aresetn] [get_bd_pins AXI4_AXIToIIC_0/s00_axi_aresetn] [get_bd_pins axi_iic_0/s_axi_aresetn]

current_bd_instance /Master
connect_bd_intf_net [get_bd_intf_pins axi_bram_ctrl_0/BRAM_PORTA] [get_bd_intf_pins blk_mem_gen_0/BRAM_PORTA]
connect_bd_intf_net [get_bd_intf_pins S_AXI] [get_bd_intf_pins axi_bram_ctrl_0/S_AXI]
connect_bd_net [get_bd_pins s_axi_aclk] [get_bd_pins axi_bram_ctrl_0/s_axi_aclk]
connect_bd_net [get_bd_pins s_axi_aresetn] [get_bd_pins axi_bram_ctrl_0/s_axi_aresetn]

current_bd_instance /TDC_Calib
connect_bd_intf_net [get_bd_intf_pins M00_AXIS_Autopush] [get_bd_intf_pins AXI4_TDC_Wrapper_0/M00_AXIS_Autopush]
connect_bd_intf_net [get_bd_intf_pins AXI4Stream_MuxDebugg_0/M00_AXIS_CT] [get_bd_intf_pins AXI4_TDC_Wrapper_0/S00_AXIS_DebugCT]
connect_bd_intf_net [get_bd_intf_pins AXI4Stream_MuxDebugg_0/S00_AXIS_DebugCT] [get_bd_intf_pins TDC/M01_AXIS_DebugCT2]
connect_bd_intf_net [get_bd_intf_pins AXI4Stream_MuxDebugg_0/S01_AXIS_DebugCT] [get_bd_intf_pins TDC/M01_AXIS_DebugCT]
connect_bd_intf_net [get_bd_intf_pins S00_AXI] [get_bd_intf_pins AXI4_TDC_Wrapper_0/S00_AXI]
connect_bd_intf_net [get_bd_intf_pins AXI4Stream_MuxDebugg_0/S02_AXIS_DebugCT] [get_bd_intf_pins TDC/M01_AXIS_DebugCT1]
connect_bd_intf_net [get_bd_intf_pins M00_BB] [get_bd_intf_pins TDC/M00_BB]
connect_bd_intf_net [get_bd_intf_pins M00_AXIS] [get_bd_intf_pins TDC/M00_AXIS]
connect_bd_net [get_bd_pins AXI4_TDC_Wrapper_0/MUX_sel] [get_bd_pins AXI4Stream_MuxDebugg_0/sel]
connect_bd_net [get_bd_pins AXI4_TDC_Wrapper_0/TDC_DEBUG_PROP_WPORT] [get_bd_pins TDC/Din_1]
connect_bd_net [get_bd_pins AXI4_TDC_Wrapper_0/TDC_PROP_WPORT] [get_bd_pins TDC/Din]
connect_bd_net [get_bd_pins reset] [get_bd_pins AXI4Stream_MuxDebugg_0/reset] [get_bd_pins AXI4_TDC_Wrapper_0/reset]
connect_bd_net [get_bd_pins TDC/Res] [get_bd_pins Res]
connect_bd_net [get_bd_pins TDC/dout] [get_bd_pins AXI4_TDC_Wrapper_0/TDC_PROP_RPORT]
connect_bd_net [get_bd_pins clk_TDC] [get_bd_pins TDC/clk_TDC]
connect_bd_net -net clk_wiz_0_clk_out1 [get_bd_pins clk_BB] \
  [get_bd_pins AXI4Stream_MuxDebugg_0/clk] [get_bd_pins AXI4_TDC_Wrapper_0/aclk] [get_bd_pins AXI4_TDC_Wrapper_0/clk] \
  [get_bd_pins TDC/clk_BB]
connect_bd_net -net reset_0_1 [get_bd_pins reset_0] [get_bd_pins TDC/reset_0]
connect_bd_net [get_bd_pins resetn] [get_bd_pins AXI4_TDC_Wrapper_0/aresetn]

current_bd_instance /TDC_Calib/TDC
connect_bd_intf_net [get_bd_intf_pins M01_AXIS_DebugCT2] [get_bd_intf_pins Sync/M01_AXIS_DebugCT]
connect_bd_intf_net [get_bd_intf_pins M01_AXIS_DebugCT1] [get_bd_intf_pins Ch2/M01_AXIS_DebugCT]
connect_bd_intf_net [get_bd_intf_pins M00_BB] [get_bd_intf_pins Ch2/M00_BB]
connect_bd_intf_net [get_bd_intf_pins M01_AXIS_DebugCT] [get_bd_intf_pins Ch1/M01_AXIS_DebugCT]
connect_bd_intf_net [get_bd_intf_pins Ch1/S00_BB] [get_bd_intf_pins Sync/M00_BB]
connect_bd_intf_net [get_bd_intf_pins Ch1/M00_BB] [get_bd_intf_pins Ch2/S00_BB]
connect_bd_intf_net [get_bd_intf_pins M00_AXIS] [get_bd_intf_pins Sync/M00_AXIS]
connect_bd_net -net BeltBus_TDL_Channel_TDC_0_Calibrated [get_bd_pins Sync/Calibrated] [get_bd_pins util_vector_logic_1/Op1]
connect_bd_net -net BeltBus_TDL_Channel_TDC_1_Calibrated [get_bd_pins Ch1/Calibrated] [get_bd_pins util_vector_logic_1/Op2]
connect_bd_net -net BeltBus_TDL_Channel_TDC_2_Calibrated [get_bd_pins Ch2/Calibrated] [get_bd_pins util_vector_logic_0/Op2]
connect_bd_net [get_bd_pins CoarseTreeDistributor_0/CoarseCounter_CTD_0] [get_bd_pins Sync/CoarseCounter_CTD]
connect_bd_net [get_bd_pins CoarseTreeDistributor_0/CoarseCounter_CTD_1] [get_bd_pins Ch1/CoarseCounter_CTD]
connect_bd_net [get_bd_pins CoarseTreeDistributor_0/CoarseCounter_CTD_2] [get_bd_pins Ch2/CoarseCounter_CTD]
connect_bd_net -net Din_1_1 [get_bd_pins Din_1] [get_bd_pins xlslice_3/Din] [get_bd_pins xlslice_4/Din] [get_bd_pins xlslice_5/Din]
connect_bd_net [get_bd_pins Din] [get_bd_pins xlslice_0/Din] [get_bd_pins xlslice_1/Din] [get_bd_pins xlslice_2/Din]
connect_bd_net [get_bd_pins StartStopGenerator_0/StartOut] [get_bd_pins Sync/CalibEventIn]
connect_bd_net [get_bd_pins StartStopGenerator_0/StopOut] [get_bd_pins Ch1/CalibEventIn] [get_bd_pins Ch2/CalibEventIn]
connect_bd_net [get_bd_pins Sync/read_reg] [get_bd_pins xlconcat_0/In0]
connect_bd_net -net TDCChannelSlice_1_read_reg [get_bd_pins Ch1/read_reg] [get_bd_pins xlconcat_0/In1]
connect_bd_net -net TDCChannelSlice_2_read_reg [get_bd_pins Ch2/read_reg] [get_bd_pins xlconcat_0/In2]
connect_bd_net [get_bd_pins clk_BB] [get_bd_pins Ch1/clk_BB] [get_bd_pins Ch2/clk_BB] [get_bd_pins Sync/clk_BB]
connect_bd_net [get_bd_pins clk_TDC] \
  [get_bd_pins Ch1/clk_TDC] [get_bd_pins Ch2/clk_TDC] [get_bd_pins CoarseTreeDistributor_0/clk] [get_bd_pins Sync/clk_TDC]
connect_bd_net -net reset_0_1 [get_bd_pins reset_0] [get_bd_pins Sync/reset_0]
connect_bd_net -net reset_TDC_1 [get_bd_pins xlconstant_0/dout] \
  [get_bd_pins Ch1/reset_TDC] [get_bd_pins Ch2/reset_TDC] [get_bd_pins CoarseTreeDistributor_0/reset] \
  [get_bd_pins StartStopGenerator_0/reset] [get_bd_pins Sync/reset_TDC]
connect_bd_net [get_bd_pins util_vector_logic_0/Res] [get_bd_pins Res]
connect_bd_net [get_bd_pins util_vector_logic_1/Res] [get_bd_pins util_vector_logic_0/Op1]
connect_bd_net [get_bd_pins xlconcat_0/dout] [get_bd_pins dout]
connect_bd_net [get_bd_pins xlslice_0/Dout] [get_bd_pins Sync/write_reg]
connect_bd_net [get_bd_pins xlslice_1/Dout] [get_bd_pins Ch1/write_reg]
connect_bd_net [get_bd_pins xlslice_2/Dout] [get_bd_pins Ch2/write_reg]
connect_bd_net [get_bd_pins xlslice_3/Dout] [get_bd_pins Sync/write_debug_reg_0]
connect_bd_net [get_bd_pins xlslice_4/Dout] [get_bd_pins Ch1/write_debug_reg_0]
connect_bd_net [get_bd_pins xlslice_5/Dout] [get_bd_pins Ch2/write_debug_reg_0]

current_bd_instance /TDC_Calib/TDC/Ch1
connect_bd_intf_net [get_bd_intf_pins AXI4Stream_OverflowC_0/m00_axis_beltbus] [get_bd_intf_pins AXI4Stream_Synchroni_0/S00_AXIS]
connect_bd_intf_net [get_bd_intf_pins M01_AXIS_DebugCT] [get_bd_intf_pins AXI4Stream_MagicCali_0/M01_AXIS_DebugCT]
connect_bd_intf_net [get_bd_intf_pins AXI4Stream_CoarseExt_0/M00_AXIS_UnCalib] [get_bd_intf_pins AXI4Stream_MagicCali_0/S00_AXIS_Uncalib]
connect_bd_intf_net [get_bd_intf_pins AXI4Stream_IperDecod_0/M00_AXIS_SubInt] [get_bd_intf_pins AXI4Stream_CoarseExt_0/S00_AXIS_SubInt]
connect_bd_intf_net [get_bd_intf_pins BeltBus_NodeInserter_0/M00_AXIS] [get_bd_intf_pins TDCChannelSlice_1/S00_AXIS_Period]
connect_bd_intf_net [get_bd_intf_pins S00_BB] [get_bd_intf_pins BeltBus_NodeInserter_0/S00_BB]
connect_bd_intf_net [get_bd_intf_pins AXI4Stream_Synchroni_0/M00_AXIS] [get_bd_intf_pins BeltBus_NodeInserter_0/S00_AXIS]
connect_bd_intf_net [get_bd_intf_pins AXI4Stream_MagicCali_0/M00_AXIS_TimeStamp] [get_bd_intf_pins AXI4Stream_OverflowC_0/s00_axis_timestamp]
connect_bd_intf_net [get_bd_intf_pins M00_BB] [get_bd_intf_pins BeltBus_NodeInserter_0/M00_BB]
connect_bd_intf_net [get_bd_intf_pins AXI4Stream_HybridTDL_0/m00_axis_undeco] [get_bd_intf_pins AXI4Stream_IperDecod_0/S00_AXIS_UnDeco]
connect_bd_net [get_bd_pins AXI4Stream_MagicCali_0/Calibrated] \
  [get_bd_pins Calibrated] [get_bd_pins TDCChannelSlice_1/Calibrated] [get_bd_pins AXI4Stream_OverflowC_0/IsCalibrated]
connect_bd_net [get_bd_pins TDCChannelSlice_1/read_reg] [get_bd_pins read_reg]
connect_bd_net [get_bd_pins clk_BB] \
  [get_bd_pins TDCChannelSlice_1/aclk] [get_bd_pins TDCChannelSlice_1/clk_BB] [get_bd_pins TDCChannelSlice_1/clk_SYS] \
  [get_bd_pins AXI4Stream_CoarseExt_0/clk_SYS] [get_bd_pins AXI4Stream_MagicCali_0/clk] \
  [get_bd_pins AXI4Stream_OverflowC_0/clk] [get_bd_pins AXI4Stream_Synchroni_0/s00_axis_aclk] \
  [get_bd_pins AXI4Stream_Synchroni_0/m00_axis_aclk] [get_bd_pins BeltBus_NodeInserter_0/clk]
connect_bd_net [get_bd_pins clk_TDC] \
  [get_bd_pins TDCChannelSlice_1/clk_TDC] [get_bd_pins AXI4Stream_IperDecod_0/clk] \
  [get_bd_pins AXI4Stream_CoarseExt_0/clk_TDC] [get_bd_pins AXI4Stream_HybridTDL_0/clk]
connect_bd_net -net write_debug_reg_0_1 [get_bd_pins write_debug_reg_0] [get_bd_pins TDCChannelSlice_1/write_debug_reg]
connect_bd_net [get_bd_pins write_reg] [get_bd_pins TDCChannelSlice_1/write_reg]
connect_bd_net [get_bd_pins xlconstant_2/dout] [get_bd_pins TDCChannelSlice_1/s00_axis_period_tvalid]
connect_bd_net [get_bd_pins reset_TDC] \
  [get_bd_pins AXI4Stream_IperDecod_0/reset] [get_bd_pins AXI4Stream_CoarseExt_0/reset_SYS] \
  [get_bd_pins AXI4Stream_CoarseExt_0/reset_TDC] [get_bd_pins AXI4Stream_MagicCali_0/reset] \
  [get_bd_pins AXI4Stream_OverflowC_0/reset] [get_bd_pins BeltBus_NodeInserter_0/reset] \
  [get_bd_pins AXI4Stream_HybridTDL_0/reset]
connect_bd_net [get_bd_pins TDCChannelSlice_1/subInterpolationMatrix] [get_bd_pins AXI4Stream_IperDecod_0/subInterpolationMatrix]
connect_bd_net [get_bd_pins CoarseCounter_CTD] [get_bd_pins AXI4Stream_CoarseExt_0/CoarseCounter_CTD]
connect_bd_net [get_bd_pins TDCChannelSlice_1/Restart_Calibration] [get_bd_pins AXI4Stream_MagicCali_0/Restart_Calibration]
connect_bd_net [get_bd_pins TDCChannelSlice_1/Stop_Calibration] [get_bd_pins AXI4Stream_MagicCali_0/Stop_Calibration]
connect_bd_net [get_bd_pins TDCChannelSlice_1/bitTrn_Uncal_addr] [get_bd_pins AXI4Stream_MagicCali_0/bitTrn_Uncal_addr]
connect_bd_net [get_bd_pins TDCChannelSlice_1/bitTrn_Cal_dout] [get_bd_pins AXI4Stream_MagicCali_0/bitTrn_Cal_dout]
connect_bd_net [get_bd_pins TDCChannelSlice_1/bitTrn_ReqSample] [get_bd_pins AXI4Stream_MagicCali_0/bitTrn_ReqSample]
connect_bd_net [get_bd_pins CalibEventIn] [get_bd_pins AXI4Stream_HybridTDL_0/AsyncInput]
connect_bd_net [get_bd_pins xlconstant_3/dout] [get_bd_pins AXI4Stream_HybridTDL_0/PolarityIn]
connect_bd_net [get_bd_pins TDCChannelSlice_1/ValidNumberOfTdl] [get_bd_pins AXI4Stream_HybridTDL_0/ValidNumberOfTdl]
connect_bd_net [get_bd_pins TDCChannelSlice_1/ValidPositionTap] [get_bd_pins AXI4Stream_HybridTDL_0/ValidPositionTap]

current_bd_instance /TDC_Calib/TDC/Ch2
connect_bd_intf_net [get_bd_intf_pins M00_BB] [get_bd_intf_pins BeltBus_NodeInserter_0/M00_BB]
connect_bd_intf_net [get_bd_intf_pins S00_BB] [get_bd_intf_pins BeltBus_NodeInserter_0/S00_BB]
connect_bd_intf_net [get_bd_intf_pins BeltBus_NodeInserter_0/M00_AXIS] [get_bd_intf_pins TDCChannelSlice_2/S00_AXIS_Period]
connect_bd_intf_net [get_bd_intf_pins AXI4Stream_OverflowC_0/m00_axis_beltbus] [get_bd_intf_pins AXI4Stream_Synchroni_0/S00_AXIS]
connect_bd_intf_net [get_bd_intf_pins AXI4Stream_IperDecod_0/M00_AXIS_SubInt] [get_bd_intf_pins AXI4Stream_CoarseExt_0/S00_AXIS_SubInt]
connect_bd_intf_net [get_bd_intf_pins M01_AXIS_DebugCT] [get_bd_intf_pins AXI4Stream_MagicCali_0/M01_AXIS_DebugCT]
connect_bd_intf_net [get_bd_intf_pins AXI4Stream_CoarseExt_0/M00_AXIS_UnCalib] [get_bd_intf_pins AXI4Stream_MagicCali_0/S00_AXIS_Uncalib]
connect_bd_intf_net [get_bd_intf_pins AXI4Stream_Synchroni_0/M00_AXIS] [get_bd_intf_pins BeltBus_NodeInserter_0/S00_AXIS]
connect_bd_intf_net [get_bd_intf_pins AXI4Stream_MagicCali_0/M00_AXIS_TimeStamp] [get_bd_intf_pins AXI4Stream_OverflowC_0/s00_axis_timestamp]
connect_bd_intf_net [get_bd_intf_pins AXI4Stream_HybridTDL_0/m00_axis_undeco] [get_bd_intf_pins AXI4Stream_IperDecod_0/S00_AXIS_UnDeco]
connect_bd_net [get_bd_pins AXI4Stream_MagicCali_0/Calibrated] \
  [get_bd_pins Calibrated] [get_bd_pins TDCChannelSlice_2/Calibrated] [get_bd_pins AXI4Stream_OverflowC_0/IsCalibrated]
connect_bd_net [get_bd_pins TDCChannelSlice_2/read_reg] [get_bd_pins read_reg]
connect_bd_net [get_bd_pins clk_BB] \
  [get_bd_pins TDCChannelSlice_2/aclk] [get_bd_pins TDCChannelSlice_2/clk_BB] [get_bd_pins TDCChannelSlice_2/clk_SYS] \
  [get_bd_pins AXI4Stream_CoarseExt_0/clk_SYS] [get_bd_pins AXI4Stream_MagicCali_0/clk] \
  [get_bd_pins AXI4Stream_OverflowC_0/clk] [get_bd_pins AXI4Stream_Synchroni_0/s00_axis_aclk] \
  [get_bd_pins AXI4Stream_Synchroni_0/m00_axis_aclk] [get_bd_pins BeltBus_NodeInserter_0/clk]
connect_bd_net [get_bd_pins clk_TDC] \
  [get_bd_pins TDCChannelSlice_2/clk_TDC] [get_bd_pins AXI4Stream_IperDecod_0/clk] \
  [get_bd_pins AXI4Stream_CoarseExt_0/clk_TDC] [get_bd_pins AXI4Stream_HybridTDL_0/clk]
connect_bd_net -net write_debug_reg_0_1 [get_bd_pins write_debug_reg_0] [get_bd_pins TDCChannelSlice_2/write_debug_reg]
connect_bd_net [get_bd_pins write_reg] [get_bd_pins TDCChannelSlice_2/write_reg]
connect_bd_net [get_bd_pins xlconstant_2/dout] [get_bd_pins TDCChannelSlice_2/s00_axis_period_tvalid]
connect_bd_net [get_bd_pins reset_TDC] \
  [get_bd_pins AXI4Stream_IperDecod_0/reset] [get_bd_pins AXI4Stream_CoarseExt_0/reset_SYS] \
  [get_bd_pins AXI4Stream_CoarseExt_0/reset_TDC] [get_bd_pins AXI4Stream_MagicCali_0/reset] \
  [get_bd_pins AXI4Stream_OverflowC_0/reset] [get_bd_pins BeltBus_NodeInserter_0/reset] \
  [get_bd_pins AXI4Stream_HybridTDL_0/reset]
connect_bd_net [get_bd_pins TDCChannelSlice_2/subInterpolationMatrix] [get_bd_pins AXI4Stream_IperDecod_0/subInterpolationMatrix]
connect_bd_net [get_bd_pins CoarseCounter_CTD] [get_bd_pins AXI4Stream_CoarseExt_0/CoarseCounter_CTD]
connect_bd_net [get_bd_pins TDCChannelSlice_2/Restart_Calibration] [get_bd_pins AXI4Stream_MagicCali_0/Restart_Calibration]
connect_bd_net [get_bd_pins TDCChannelSlice_2/Stop_Calibration] [get_bd_pins AXI4Stream_MagicCali_0/Stop_Calibration]
connect_bd_net [get_bd_pins TDCChannelSlice_2/bitTrn_Uncal_addr] [get_bd_pins AXI4Stream_MagicCali_0/bitTrn_Uncal_addr]
connect_bd_net [get_bd_pins TDCChannelSlice_2/bitTrn_Cal_dout] [get_bd_pins AXI4Stream_MagicCali_0/bitTrn_Cal_dout]
connect_bd_net [get_bd_pins TDCChannelSlice_2/bitTrn_ReqSample] [get_bd_pins AXI4Stream_MagicCali_0/bitTrn_ReqSample]
connect_bd_net [get_bd_pins CalibEventIn] [get_bd_pins AXI4Stream_HybridTDL_0/AsyncInput]
connect_bd_net [get_bd_pins xlconstant_3/dout] [get_bd_pins AXI4Stream_HybridTDL_0/PolarityIn]
connect_bd_net [get_bd_pins TDCChannelSlice_2/ValidPositionTap] [get_bd_pins AXI4Stream_HybridTDL_0/ValidPositionTap]
connect_bd_net [get_bd_pins TDCChannelSlice_2/ValidNumberOfTdl] [get_bd_pins AXI4Stream_HybridTDL_0/ValidNumberOfTdl]

current_bd_instance /TDC_Calib/TDC/Sync
connect_bd_intf_net [get_bd_intf_pins AXI4Stream_Synchroni_0/M00_AXIS] [get_bd_intf_pins BeltBus_NodeInserter_0/S00_AXIS]
connect_bd_intf_net [get_bd_intf_pins AXI4Stream_PeriodMet_0/M00_AXIS] [get_bd_intf_pins axis_broadcaster_0/S_AXIS]
connect_bd_intf_net [get_bd_intf_pins AXI4Stream_Synchroni_0/S00_AXIS] [get_bd_intf_pins AXI4Stream_OverflowC_0/m00_axis_beltbus]
connect_bd_intf_net [get_bd_intf_pins TDCChannelSlice_0/S00_AXIS_Period] [get_bd_intf_pins axis_broadcaster_0/M01_AXIS]
connect_bd_intf_net [get_bd_intf_pins AXI4Stream_MagicCali_0/M00_AXIS_TimeStamp] [get_bd_intf_pins AXI4Stream_OverflowC_0/s00_axis_timestamp]
connect_bd_intf_net [get_bd_intf_pins M00_AXIS] [get_bd_intf_pins axis_broadcaster_0/M00_AXIS]
connect_bd_intf_net [get_bd_intf_pins M01_AXIS_DebugCT] [get_bd_intf_pins AXI4Stream_MagicCali_0/M01_AXIS_DebugCT]
connect_bd_intf_net [get_bd_intf_pins M00_BB] [get_bd_intf_pins BeltBus_NodeInserter_0/M00_BB]
connect_bd_intf_net [get_bd_intf_pins S00_BB_0] [get_bd_intf_pins BeltBus_NodeInserter_0/S00_BB]
connect_bd_intf_net [get_bd_intf_pins BeltBus_NodeInserter_0/M00_AXIS] [get_bd_intf_pins AXI4Stream_PeriodMet_0/S00_BB]
connect_bd_intf_net [get_bd_intf_pins AXI4Stream_CoarseExt_0/M00_AXIS_UnCalib] [get_bd_intf_pins AXI4Stream_MagicCali_0/S00_AXIS_Uncalib]
connect_bd_intf_net [get_bd_intf_pins AXI4Stream_IperDecod_0/M00_AXIS_SubInt] [get_bd_intf_pins AXI4Stream_CoarseExt_0/S00_AXIS_SubInt]
connect_bd_intf_net [get_bd_intf_pins AXI4Stream_HybridTDL_0/m00_axis_undeco] [get_bd_intf_pins AXI4Stream_IperDecod_0/S00_AXIS_UnDeco]
connect_bd_net [get_bd_pins AXI4Stream_MagicCali_0/Calibrated] \
  [get_bd_pins Calibrated] [get_bd_pins TDCChannelSlice_0/Calibrated] [get_bd_pins AXI4Stream_OverflowC_0/IsCalibrated]
connect_bd_net [get_bd_pins TDCChannelSlice_0/read_reg] [get_bd_pins read_reg]
connect_bd_net [get_bd_pins clk_BB] \
  [get_bd_pins AXI4Stream_PeriodMet_0/clk] [get_bd_pins TDCChannelSlice_0/aclk] [get_bd_pins TDCChannelSlice_0/clk_BB] \
  [get_bd_pins TDCChannelSlice_0/clk_SYS] [get_bd_pins axis_broadcaster_0/aclk] [get_bd_pins AXI4Stream_CoarseExt_0/clk_SYS] \
  [get_bd_pins AXI4Stream_MagicCali_0/clk] [get_bd_pins AXI4Stream_OverflowC_0/clk] \
  [get_bd_pins AXI4Stream_Synchroni_0/s00_axis_aclk] [get_bd_pins AXI4Stream_Synchroni_0/m00_axis_aclk] \
  [get_bd_pins BeltBus_NodeInserter_0/clk]
connect_bd_net [get_bd_pins clk_TDC] \
  [get_bd_pins TDCChannelSlice_0/clk_TDC] [get_bd_pins AXI4Stream_IperDecod_0/clk] \
  [get_bd_pins AXI4Stream_CoarseExt_0/clk_TDC] [get_bd_pins AXI4Stream_HybridTDL_0/clk]
connect_bd_net -net reset_0_1 [get_bd_pins reset_0] [get_bd_pins axis_broadcaster_0/aresetn] [get_bd_pins util_vector_logic_0/Op1]
connect_bd_net [get_bd_pins util_vector_logic_0/Res] [get_bd_pins AXI4Stream_PeriodMet_0/reset]
connect_bd_net -net write_debug_reg_0_1 [get_bd_pins write_debug_reg_0] [get_bd_pins TDCChannelSlice_0/write_debug_reg]
connect_bd_net [get_bd_pins write_reg] [get_bd_pins TDCChannelSlice_0/write_reg]
connect_bd_net [get_bd_pins reset_TDC] \
  [get_bd_pins AXI4Stream_IperDecod_0/reset] [get_bd_pins AXI4Stream_CoarseExt_0/reset_SYS] \
  [get_bd_pins AXI4Stream_CoarseExt_0/reset_TDC] [get_bd_pins AXI4Stream_MagicCali_0/reset] \
  [get_bd_pins AXI4Stream_OverflowC_0/reset] [get_bd_pins BeltBus_NodeInserter_0/reset] \
  [get_bd_pins AXI4Stream_HybridTDL_0/reset]
connect_bd_net [get_bd_pins TDCChannelSlice_0/subInterpolationMatrix] [get_bd_pins AXI4Stream_IperDecod_0/subInterpolationMatrix]
connect_bd_net [get_bd_pins CoarseCounter_CTD] [get_bd_pins AXI4Stream_CoarseExt_0/CoarseCounter_CTD]
connect_bd_net [get_bd_pins TDCChannelSlice_0/Restart_Calibration] [get_bd_pins AXI4Stream_MagicCali_0/Restart_Calibration]
connect_bd_net [get_bd_pins TDCChannelSlice_0/Stop_Calibration] [get_bd_pins AXI4Stream_MagicCali_0/Stop_Calibration]
connect_bd_net [get_bd_pins TDCChannelSlice_0/bitTrn_Uncal_addr] [get_bd_pins AXI4Stream_MagicCali_0/bitTrn_Uncal_addr]
connect_bd_net [get_bd_pins TDCChannelSlice_0/bitTrn_Cal_dout] [get_bd_pins AXI4Stream_MagicCali_0/bitTrn_Cal_dout]
connect_bd_net [get_bd_pins TDCChannelSlice_0/bitTrn_ReqSample] [get_bd_pins AXI4Stream_MagicCali_0/bitTrn_ReqSample]
connect_bd_net [get_bd_pins CalibEventIn] [get_bd_pins AXI4Stream_HybridTDL_0/AsyncInput]
connect_bd_net [get_bd_pins xlconstant_2/dout] [get_bd_pins AXI4Stream_HybridTDL_0/PolarityIn]
connect_bd_net [get_bd_pins TDCChannelSlice_0/ValidNumberOfTdl] [get_bd_pins AXI4Stream_HybridTDL_0/ValidNumberOfTdl]
connect_bd_net [get_bd_pins TDCChannelSlice_0/ValidPositionTap] [get_bd_pins AXI4Stream_HybridTDL_0/ValidPositionTap]
